# EAGLE design EndStop (EAGLE 7.2.0)
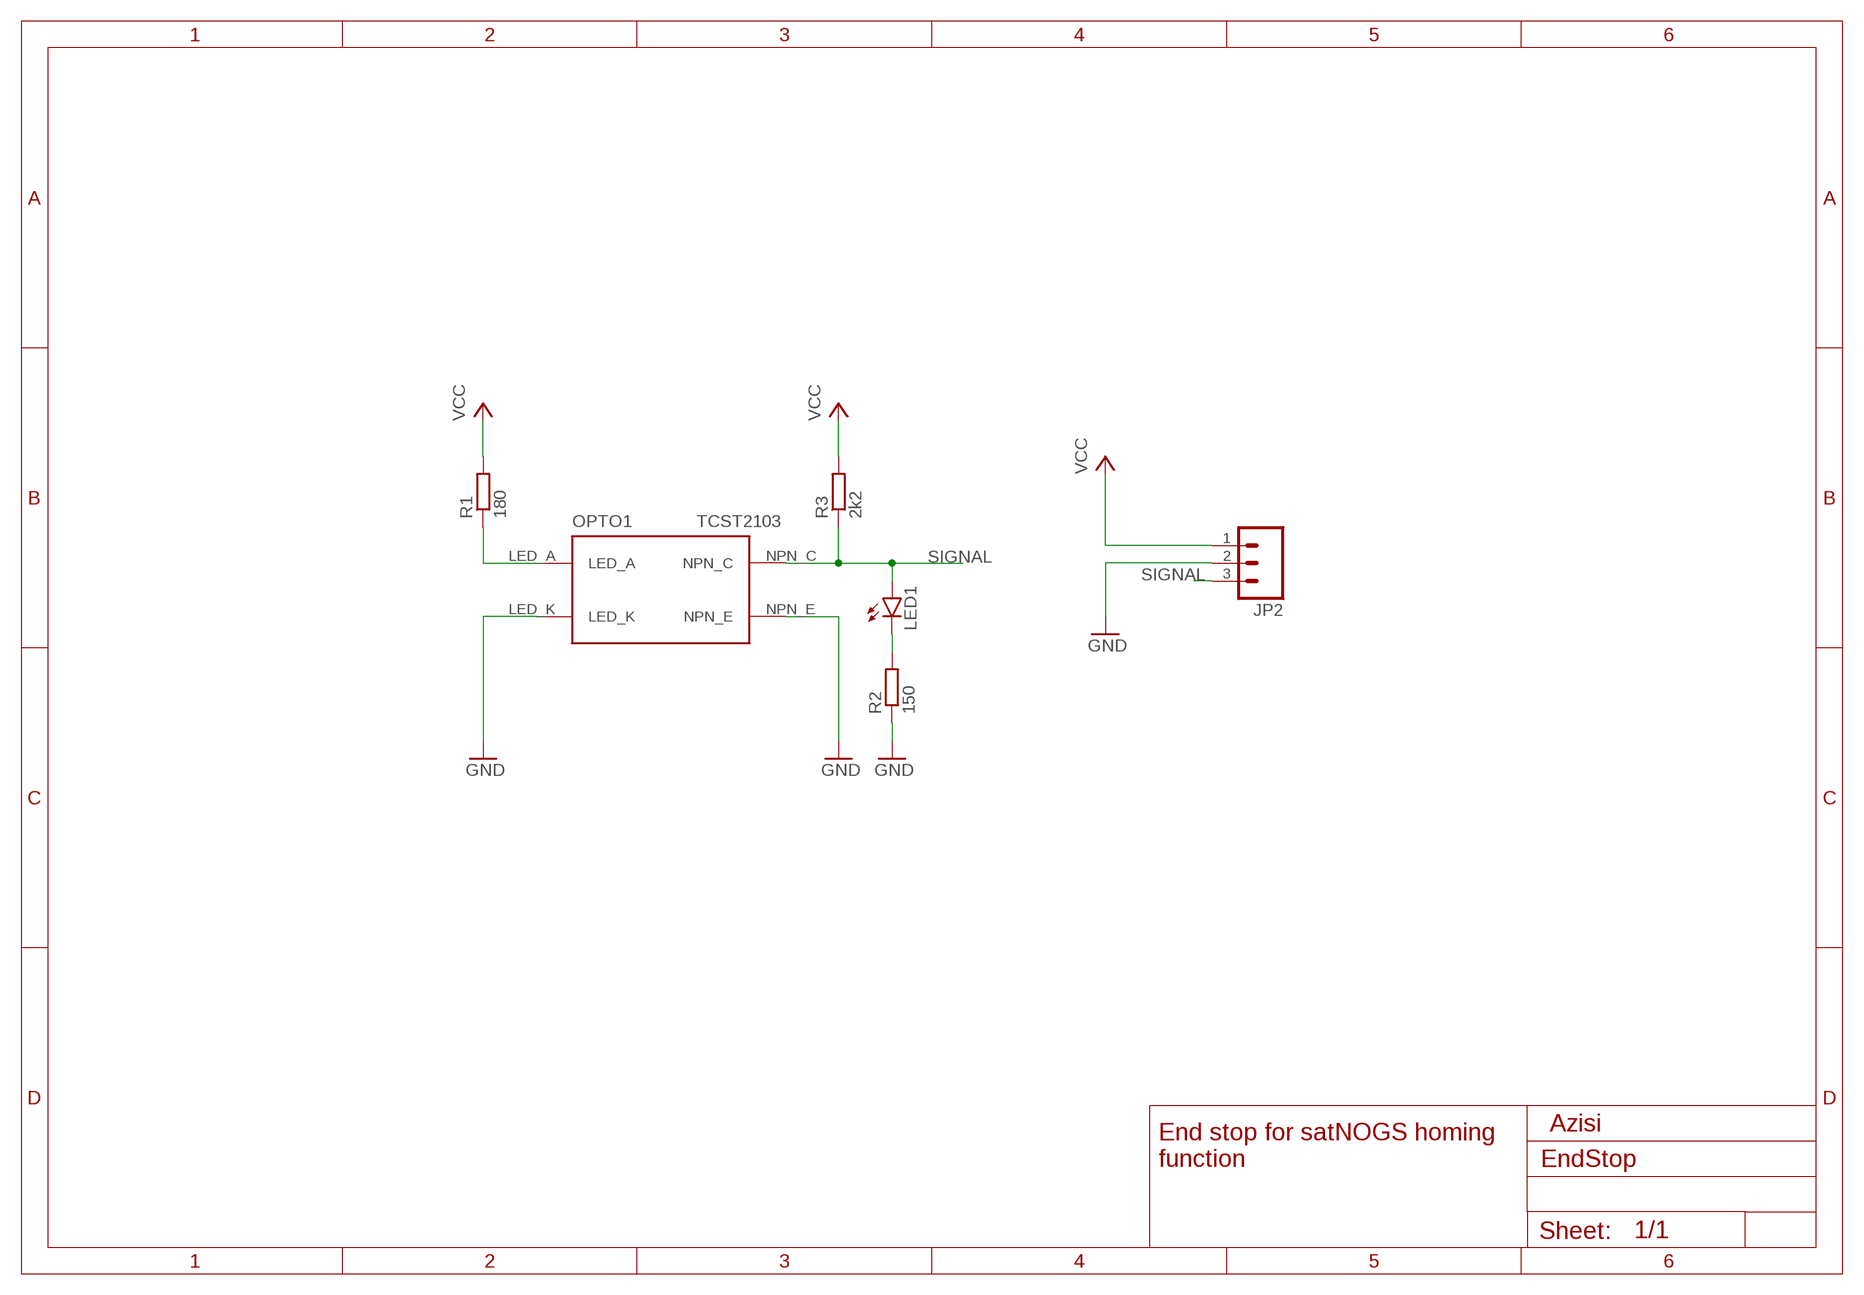
[diagram p0: schematic, sheet 1]

## Parts
JP2  M03PTH  [1X03]
LED1  LED3MM  [LED3MM]
OPTO1  TCST2103  [TCST2013]
R1  180  R-EU_M0805  [M0805]
R2  150  R-EU_M0805  [M0805]
R3  2k2  R-EU_M0805  [M0805]

## Nets
GND: JP2.2 OPTO1.LED_K OPTO1.NPN_E R2.1
N$2: OPTO1.LED_A R1.1
N$7: LED1.K(C) R2.2
SIGNAL: JP2.3 LED1.A OPTO1.NPN_C R3.1
VCC: JP2.1 R1.2 R3.2

## Notes on the sheet
- Azisi
- End stop for satNOGS homing
  function

## Library data of the parts
JP2 = SparkFun-Connectors:M03: Header 3 Standard 3-pin 0.1" header. Use with straight break away headers (SKU : PRT-00116), right angle break away headers (PRT-00553), swiss pins (PRT-00743), machine pins (PRT-00117), and female headers (PRT-00115). Molex polarized connector foot print use with SKU : PRT-08232 with associated crimp pins and housings.
LED1 = SparkFun-LED:LED: LEDs Standard schematic elements and footprints for 5mm, 3mm, 1206, and 0603 sized LEDs. 5mm - Spark Fun Electronics SKU : COM-00529 (and others)
OPTO1 = satnogs:TCST2103
R1-R3 = rcl:R-EU_: RESISTOR, European symbol

## Board
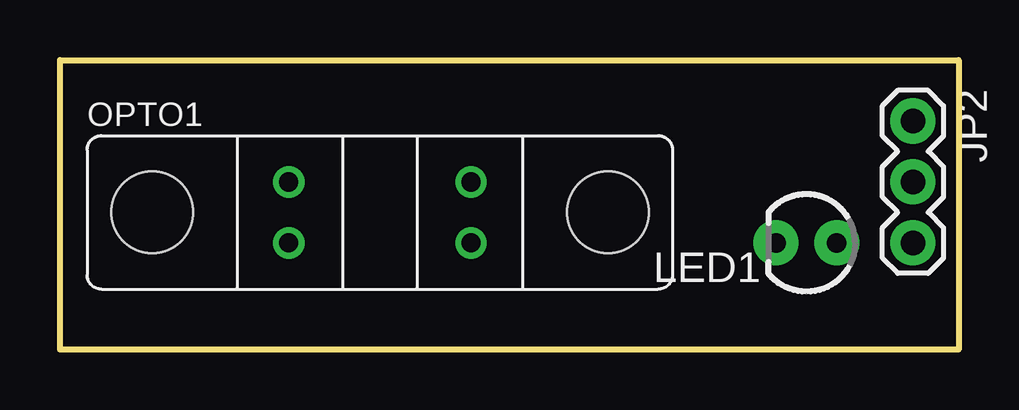
[diagram p1: board, top side]
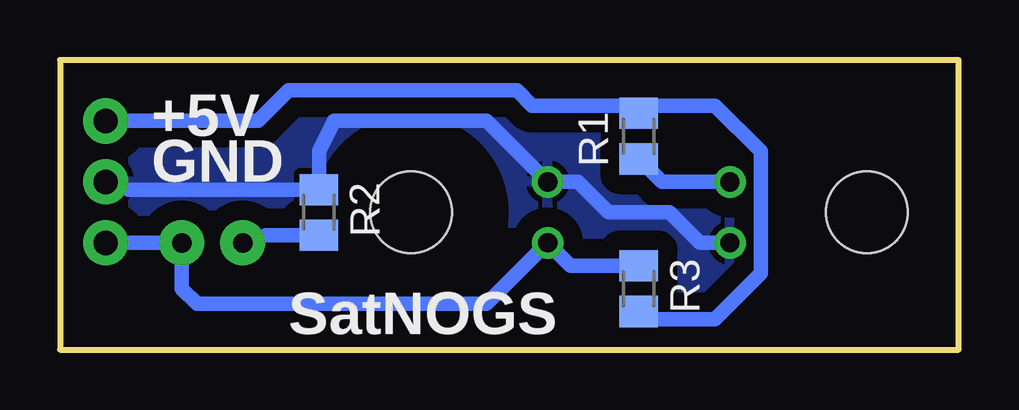
[diagram p2: board, bottom side, seen from below]

Size 37.47 x 12.06 mm. Coordinates in mm from the lower left corner, seen from the top.
Outline: 0,0 0,12.06 37.47,12.06 37.47,0 0,0
Copper layers (1*16): Top 0.035mm / dielectric 1.5mm / Bottom 0.035mm
Design rules "SeeedStudio_2layer_DRU_no_angle_20140221": minimum track width 6mil, minimum drill 12mil, track to track 6mil, track to pad 6mil, pad to pad 6mil, via to via 6mil, smd to smd 0mil, copper to edge 10mil, drill to drill 10mil, minimum pad ring 10mil, minimum via ring 6mil, stop-mask expansion 2mil, vias tented up to drill 100mil, thermal gap 10mil

### Footprints (pad centres in the part's own frame; a part is rotated, then mirrored left to right if it is on the bottom)
1X03 = drill 1.016 pad 1.88: 1 0,0; 2 2.54,0; 3 5.08,0
LED3MM = drill 0.813 pad 1.88: A -1.27,0; K 1.27,0
TCST2013 = drill 0.8: LED_A -3.8,1.27; LED_K -3.8,-1.27; NPN_C 3.8,-1.27; NPN_E 3.8,1.27 | hole 3.4: -9.5,0; 9.5,0
M0805 = smd 1.3 x 1.6: 1 -0.95,0; 2 0.95,0

### Placement (x,y rotation side)
JP2  35.56,9.53 270 top
LED1  31.11,4.45 180 top
OPTO1  13.34,5.71 0 top
R1  13.34,8.89 90 bottom
R2  26.67,5.71 270 bottom
R3  13.34,2.54 270 bottom

### Tracks (layer width: path | path; a pad name or v marks a point on that pad's centre or on a via)
GND
  Bottom 0.61: OPTO1.LED_K 10.79,4.45 12.06,5.71 14.61,5.71 15.88,6.99 OPTO1.NPN_E 19.68,9.53 26.04,9.53 26.67,8.26 R2.1 34.6,6.67 JP2.2
  pour Bottom (isolate 0.813): 0,0 37.47,0 37.47,12.06 0,12.06
N$2
  Bottom 0.61: OPTO1.LED_A 12.38,6.99 R1.1
N$7
  Bottom 0.61: R2.2 28.89,4.76 LED1.K
SIGNAL
  Bottom 0.61: JP2.3 LED1.A 32.38,2.54 31.75,1.91 19.68,1.91 OPTO1.NPN_C 16.18,3.49 R3.1
VCC
  Bottom 0.61: 13.02,9.53 R1.2 | R3.2 13.02,1.27 10.16,1.27 8.26,3.17 8.26,8.26 10.16,10.16 13.02,10.16 R1.2 | JP2.1 29.21,9.53 27.94,10.79 18.41,10.79 17.78,10.16 13.65,10.16 R1.2

### Text on the board
bPlace: +5V | GND | SatNOGS